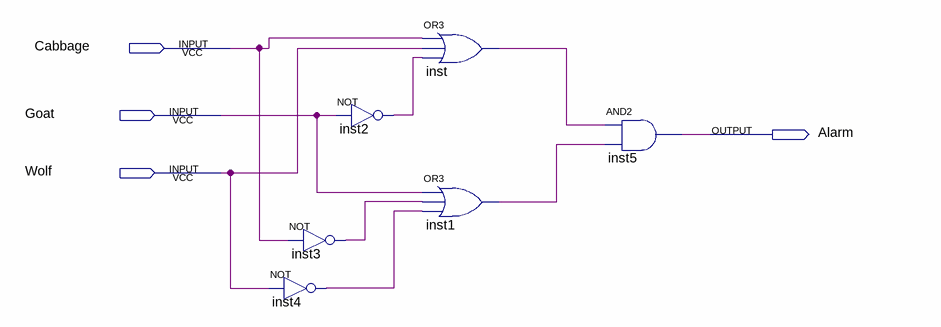
[diagram p0: schematic sheet]
// Quartus schematic lab3step0.bdf as structural Verilog: 6 symbols, 4 pins
module lab3step0 (
  input  Cabbage,
  input  Goat,
  input  Wolf,
  output Alarm
);

  wire inst1_out, inst2_out, inst3_out, inst4_out, inst_out;

  not inst4 (inst4_out, Wolf);
  not inst2 (inst2_out, Goat);
  not inst3 (inst3_out, Cabbage);
  or inst (inst_out, Cabbage, Wolf, inst2_out);
  or inst1 (inst1_out, Goat, inst3_out, inst4_out);
  and inst5 (Alarm, inst_out, inst1_out);
endmodule
